# EAGLE design IRIS1304_v2.0 (EAGLE 6.6.0)

## Sheet 1 of 4
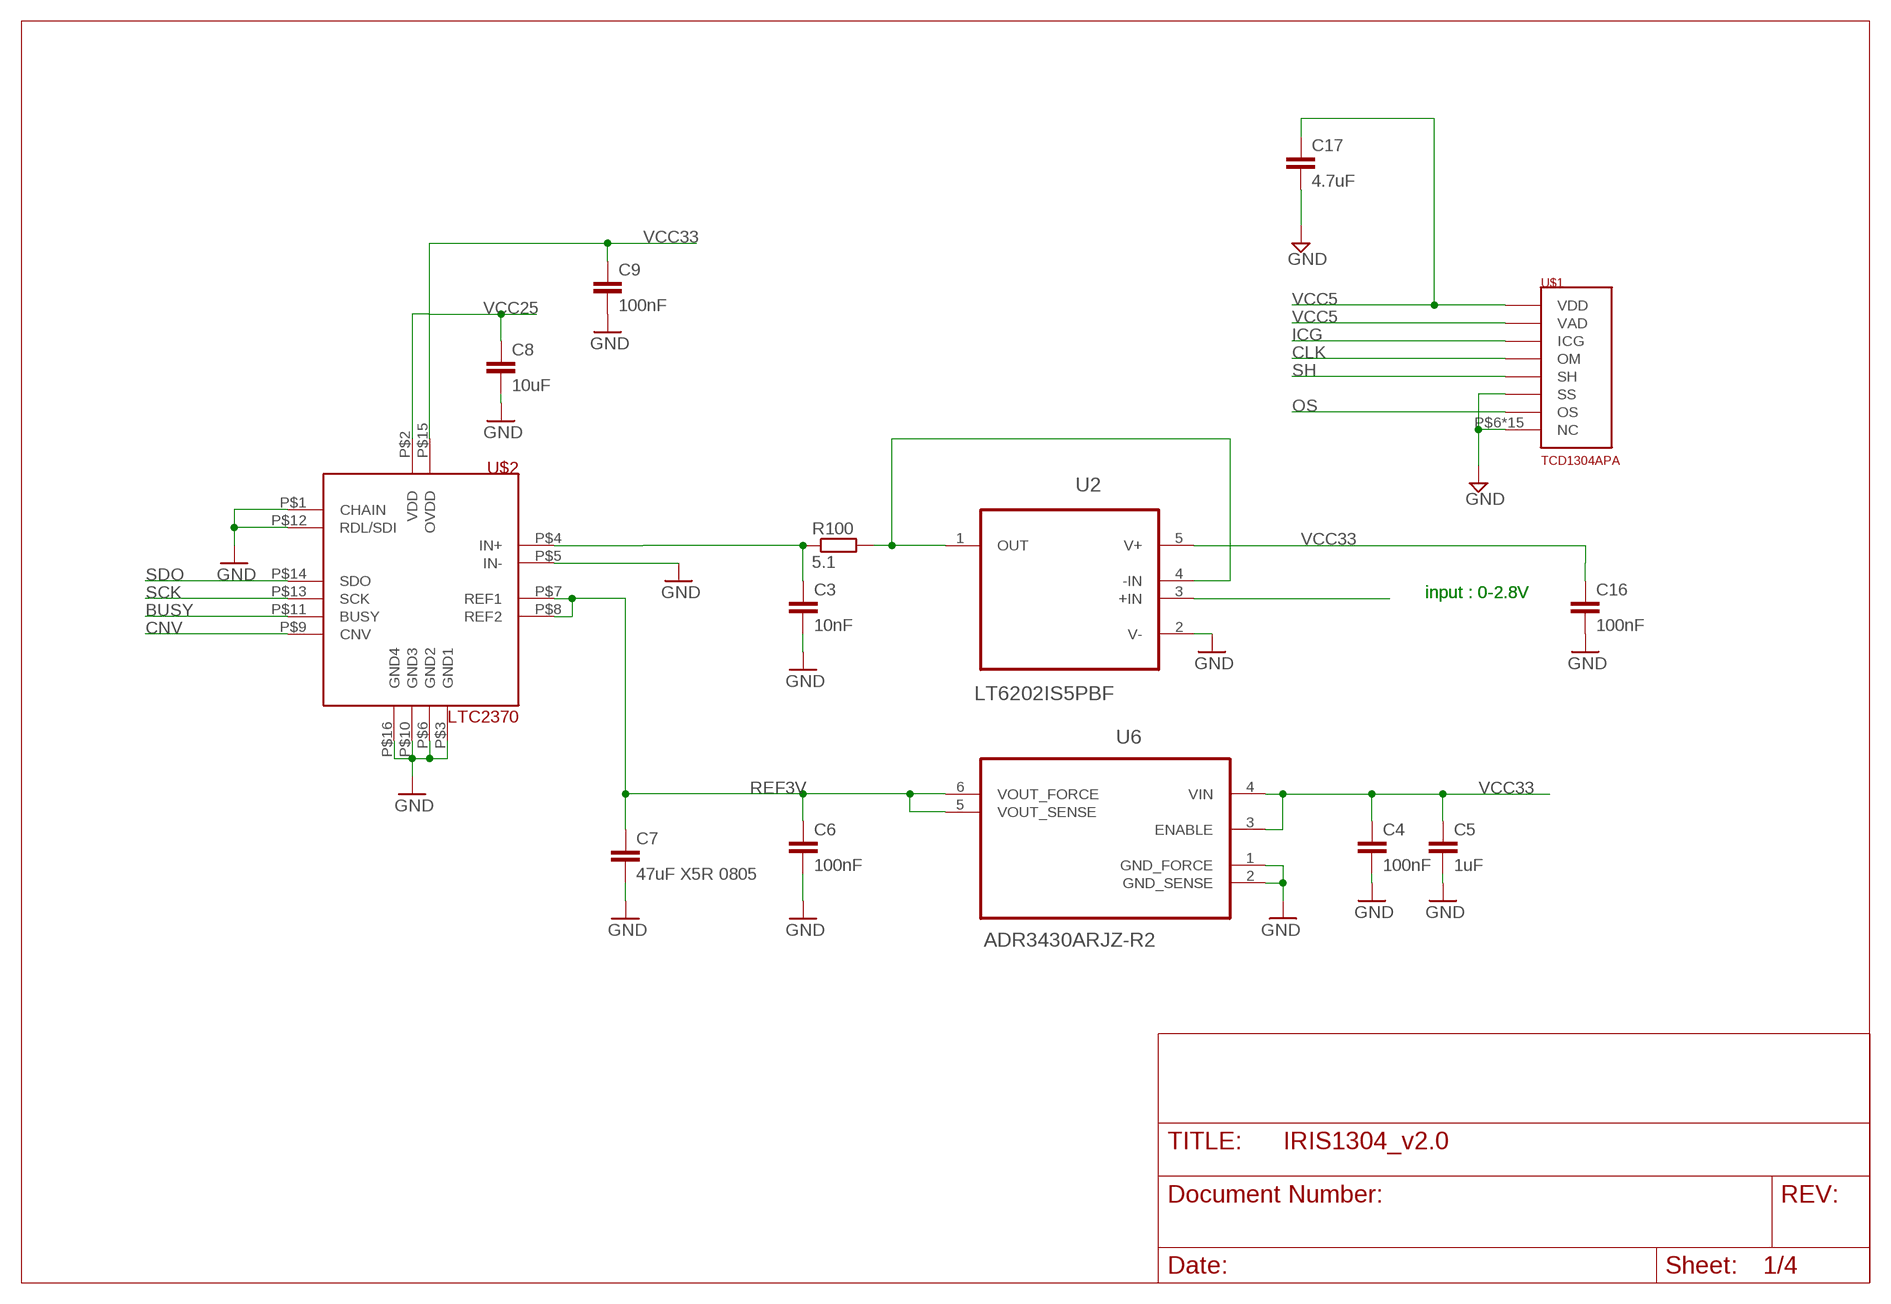
[diagram p0: schematic, sheet 1]

### Parts
C3  10nF  C-EUC0603  [C0603]
C4  100nF  C-EUC0603  [C0603]
C5  1uF  C-EUC0603  [C0603]
C6  100nF  C-EUC0603  [C0603]
C7  47uF X5R 0805  C-EUC0805  [C0805]
C8  10uF  C-EUC0603  [C0603]
C9  100nF  C-EUC0603  [C0603]
C16  100nF  C-EUC0603  [C0603]
C17  4.7uF  C-EUC0603  [C0603]
R100  5.1  R-EU_R0603  [R0603]
U2  LT6202IS5PBF  [SOT95P280X100-5N]
U6  ADR3430ARJZ-R2  [SOT95P280X145-6N]
U$1  TCD1304APA  [ILX511]
U$2  LTC2370  [MSOP-16]

### Nets
BUSY: U$2.P$11(BUSY) ; also sheet 2
CLK: U$1.P$4(OM) ; also sheet 2
CNV: U$2.P$9(CNV) ; also sheet 2
GND: C3.2 C4.2 C5.2 C6.2 C7.2 C8.2 C9.2 C16.2 C17.2 U2.2(V-) U6.1(GND_FORCE) U6.2(GND_SENSE) U$1.P$6(NC) U$1.P$7(NC) U$1.P$8(NC) U$1.P$9(NC) U$1.P$10(NC) U$1.P$11(NC) U$1.P$12(NC) U$1.P$13(NC) U$1.P$14(NC) U$1.P$15(NC) U$1.P$16(NC) U$1.P$17(NC) U$1.P$18(NC) U$1.P$19(NC) U$1.P$20(NC) U$1.P$22(SS) U$2.P$1(CHAIN) U$2.P$3(GND1) U$2.P$5(IN-) U$2.P$6(GND2) U$2.P$10(GND3) U$2.P$12(RDL/SDI) U$2.P$16(GND4) ; also sheet 2,3,4
ICG: U$1.P$3(ICG) ; also sheet 2
N$3: C3.1 R100.1 U$2.P$4(IN+)
N$11: R100.2 U2.1(OUT) U2.4(-IN)
OS: U2.3(+IN) U$1.P$21(OS)
REF3V: C6.1 C7.1 U6.5(VOUT_SENSE) U6.6(VOUT_FORCE) U$2.P$7(REF1) U$2.P$8(REF2)
SCK: U$2.P$13(SCK) ; also sheet 2
SDO: U$2.P$14(SDO) ; also sheet 2
SH: U$1.P$5(SH) ; also sheet 2
VCC5: C17.1 U$1.P$1(VDD) U$1.P$2(VAD) ; also sheet 3,4
VCC25: C8.1 U$2.P$2(VDD) ; also sheet 2,4
VCC33: C4.1 C5.1 C9.1 C16.1 U2.5(V+) U6.3(ENABLE) U6.4(VIN) U$2.P$15(OVDD) ; also sheet 2,3,4

### Notes on the sheet
- input : 0-2.8V | input : 0-2.8V

## Sheet 2 of 4
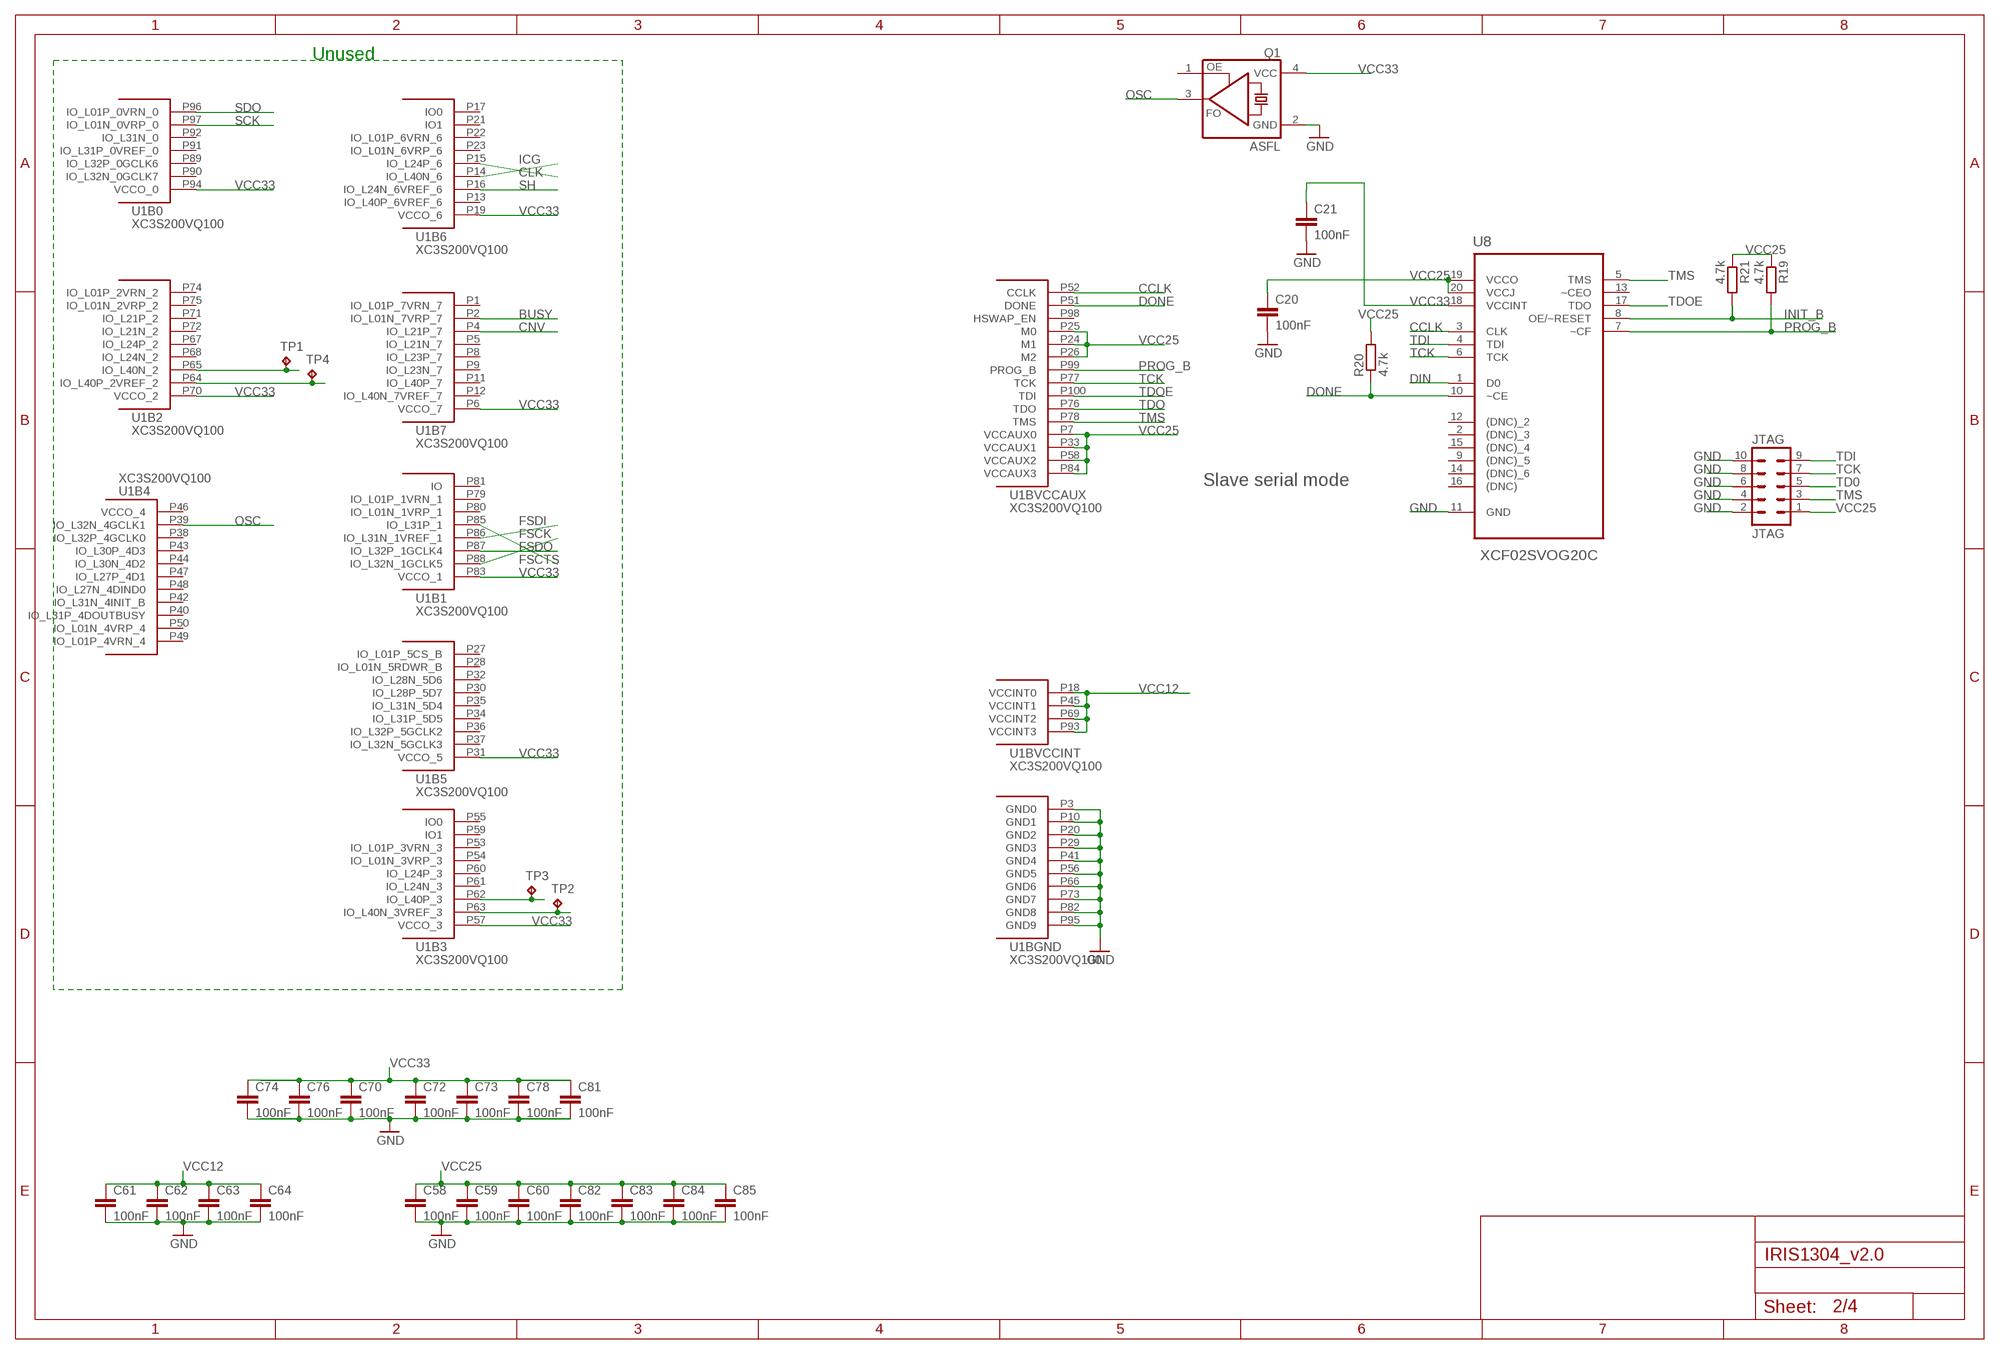
[diagram p1: schematic, sheet 2]

### Parts
C20  100nF  C-EUC0603  [C0603]
C21  100nF  C-EUC0603  [C0603]
C58  100nF  C-EUC0603  [C0603]
C59  100nF  C-EUC0603  [C0603]
C60  100nF  C-EUC0603  [C0603]
C61  100nF  C-EUC0603  [C0603]
C62  100nF  C-EUC0603  [C0603]
C63  100nF  C-EUC0603  [C0603]
C64  100nF  C-EUC0603  [C0603]
C70  100nF  C-EUC0603  [C0603]
C72  100nF  C-EUC0603  [C0603]
C73  100nF  C-EUC0603  [C0603]
C74  100nF  C-EUC0603  [C0603]
C76  100nF  C-EUC0603  [C0603]
C78  100nF  C-EUC0603  [C0603]
C81  100nF  C-EUC0603  [C0603]
C82  100nF  C-EUC0603  [C0603]
C83  100nF  C-EUC0603  [C0603]
C84  100nF  C-EUC0603  [C0603]
C85  100nF  C-EUC0603  [C0603]
JTAG  JTAG  ML10  [ML10]
Q1  ASFL  [ASF]
R19  4.7k  R-EU_R0603  [R0603]
R20  4.7k  R-EU_R0603  [R0603]
R21  4.7k  R-EU_R0603  [R0603]
TP1  TPB1,27  [B1,27]
TP2  TPB1,27  [B1,27]
TP3  TPB1,27  [B1,27]
TP4  TPB1,27  [B1,27]
U1  XC3S200VQ100  [VQ100]
U8  XCF02SVOG20C  [SOP65P640X119-20N]

### Nets
BUSY: U1.P2(B7:IO_L01N_7VRP_7) ; also sheet 1
CCLK: U1.P52(BVCCAUX:CCLK) U8.3(CLK)
CLK: U1.P15(B6:IO_L24P_6) ; also sheet 1
CNV: U1.P4(B7:IO_L21P_7) ; also sheet 1
DIN: U8.1(D0)
DONE: R20.1 U1.P51(BVCCAUX:DONE) U8.10(~CE)
FSCK: U1.P88(B1:IO_L32N_1GCLK5) ; also sheet 3
FSCTS: U1.P85(B1:IO_L31P_1) ; also sheet 3
FSDI: U1.P86(B1:IO_L31N_1VREF_1) ; also sheet 3
FSDO: U1.P87(B1:IO_L32P_1GCLK4) ; also sheet 3
GND: C20.2 C21.2 C58.2 C59.2 C60.2 C61.2 C62.2 C63.2 C64.2 C70.2 C72.2 C73.2 C74.2 C76.2 C78.2 C81.2 C82.2 C83.2 C84.2 C85.2 JTAG.2 JTAG.4 JTAG.6 JTAG.8 JTAG.10 Q1.2(GND) U1.P3(BGND:GND0) U1.P10(BGND:GND1) U1.P20(BGND:GND2) U1.P29(BGND:GND3) U1.P41(BGND:GND4) U1.P56(BGND:GND5) U1.P66(BGND:GND6) U1.P73(BGND:GND7) U1.P82(BGND:GND8) U1.P95(BGND:GND9) U8.11(GND) ; also sheet 1,3,4
ICG: U1.P14(B6:IO_L40N_6) ; also sheet 1
INIT_B: R21.2 U8.8(OE/~RESET)
N$1: TP2.TP U1.P63(B3:IO_L40N_3VREF_3)
N$2: TP4.TP U1.P64(B2:IO_L40P_2VREF_2)
N$4: TP3.TP U1.P62(B3:IO_L40P_3)
N$5: TP1.TP U1.P65(B2:IO_L40N_2)
OSC: Q1.3(FO) U1.P39(B4:IO_L32N_4GCLK1)
PROG_B: R19.2 U1.P99(BVCCAUX:PROG_B) U8.7(~CF)
SCK: U1.P97(B0:IO_L01N_0VRP_0) ; also sheet 1
SDO: U1.P96(B0:IO_L01P_0VRN_0) ; also sheet 1
SH: U1.P16(B6:IO_L24N_6VREF_6) ; also sheet 1
TCK: JTAG.7 U1.P77(BVCCAUX:TCK) U8.6(TCK)
TD0: JTAG.5
TDI: JTAG.9 U8.4(TDI)
TDO: U1.P76(BVCCAUX:TDO)
TDOE: U1.P100(BVCCAUX:TDI) U8.17(TDO)
TMS: JTAG.3 U1.P78(BVCCAUX:TMS) U8.5(TMS)
VCC12: C61.1 C62.1 C63.1 C64.1 U1.P18(BVCCINT:VCCINT0) U1.P45(BVCCINT:VCCINT1) U1.P69(BVCCINT:VCCINT2) U1.P93(BVCCINT:VCCINT3) ; also sheet 4
VCC25: C20.1 C58.1 C59.1 C60.1 C82.1 C83.1 C84.1 C85.1 JTAG.1 R19.1 R20.2 R21.1 U1.P7(BVCCAUX:VCCAUX0) U1.P24(BVCCAUX:M1) U1.P25(BVCCAUX:M0) U1.P26(BVCCAUX:M2) U1.P33(BVCCAUX:VCCAUX1) U1.P58(BVCCAUX:VCCAUX2) U1.P84(BVCCAUX:VCCAUX3) U8.19(VCCO) U8.20(VCCJ) ; also sheet 1,4
VCC33: C21.1 C70.1 C72.1 C73.1 C74.1 C76.1 C78.1 C81.1 Q1.4(VCC) U1.P6(B7:VCCO_7) U1.P19(B6:VCCO_6) U1.P31(B5:VCCO_5) U1.P57(B3:VCCO_3) U1.P70(B2:VCCO_2) U1.P83(B1:VCCO_1) U1.P94(B0:VCCO_0) U8.18(VCCINT) ; also sheet 1,3,4
Unconnected: Q1.1(OE) U1.P1(B7:IO_L01P_7VRN_7) U1.P5(B7:IO_L21N_7) U1.P8(B7:IO_L23P_7) U1.P9(B7:IO_L23N_7) U1.P11(B7:IO_L40P_7) U1.P12(B7:IO_L40N_7VREF_7) U1.P13(B6:IO_L40P_6VREF_6) U1.P17(B6:IO0) U1.P21(B6:IO1) U1.P22(B6:IO_L01P_6VRN_6) U1.P23(B6:IO_L01N_6VRP_6) U1.P27(B5:IO_L01P_5CS_B) U1.P28(B5:IO_L01N_5RDWR_B) U1.P30(B5:IO_L28P_5D7) U1.P32(B5:IO_L28N_5D6) U1.P34(B5:IO_L31P_5D5) U1.P35(B5:IO_L31N_5D4) U1.P36(B5:IO_L32P_5GCLK2) U1.P37(B5:IO_L32N_5GCLK3) U1.P38(B4:IO_L32P_4GCLK0) U1.P40(B4:IO_L31P_4DOUTBUSY) U1.P42(B4:IO_L31N_4INIT_B) U1.P43(B4:IO_L30P_4D3) U1.P44(B4:IO_L30N_4D2) U1.P46(B4:VCCO_4) U1.P47(B4:IO_L27P_4D1) U1.P48(B4:IO_L27N_4DIND0) U1.P49(B4:IO_L01P_4VRN_4) U1.P50(B4:IO_L01N_4VRP_4) U1.P53(B3:IO_L01P_3VRN_3) U1.P54(B3:IO_L01N_3VRP_3) U1.P55(B3:IO0) U1.P59(B3:IO1) U1.P60(B3:IO_L24P_3) U1.P61(B3:IO_L24N_3) U1.P67(B2:IO_L24P_2) U1.P68(B2:IO_L24N_2) U1.P71(B2:IO_L21P_2) U1.P72(B2:IO_L21N_2) U1.P74(B2:IO_L01P_2VRN_2) U1.P75(B2:IO_L01N_2VRP_2) U1.P79(B1:IO_L01P_1VRN_1) U1.P80(B1:IO_L01N_1VRP_1) U1.P81(B1:IO) U1.P89(B0:IO_L32P_0GCLK6) U1.P90(B0:IO_L32N_0GCLK7) U1.P91(B0:IO_L31P_0VREF_0) U1.P92(B0:IO_L31N_0) U1.P98(BVCCAUX:HSWAP_EN) U8.2((DNC)_3) U8.9((DNC)_5) U8.12((DNC)_2) U8.13(~CEO) U8.14((DNC)_6) U8.15((DNC)_4) U8.16((DNC))

### Notes on the sheet
- Unused
- Slave serial mode

## Sheet 3 of 4
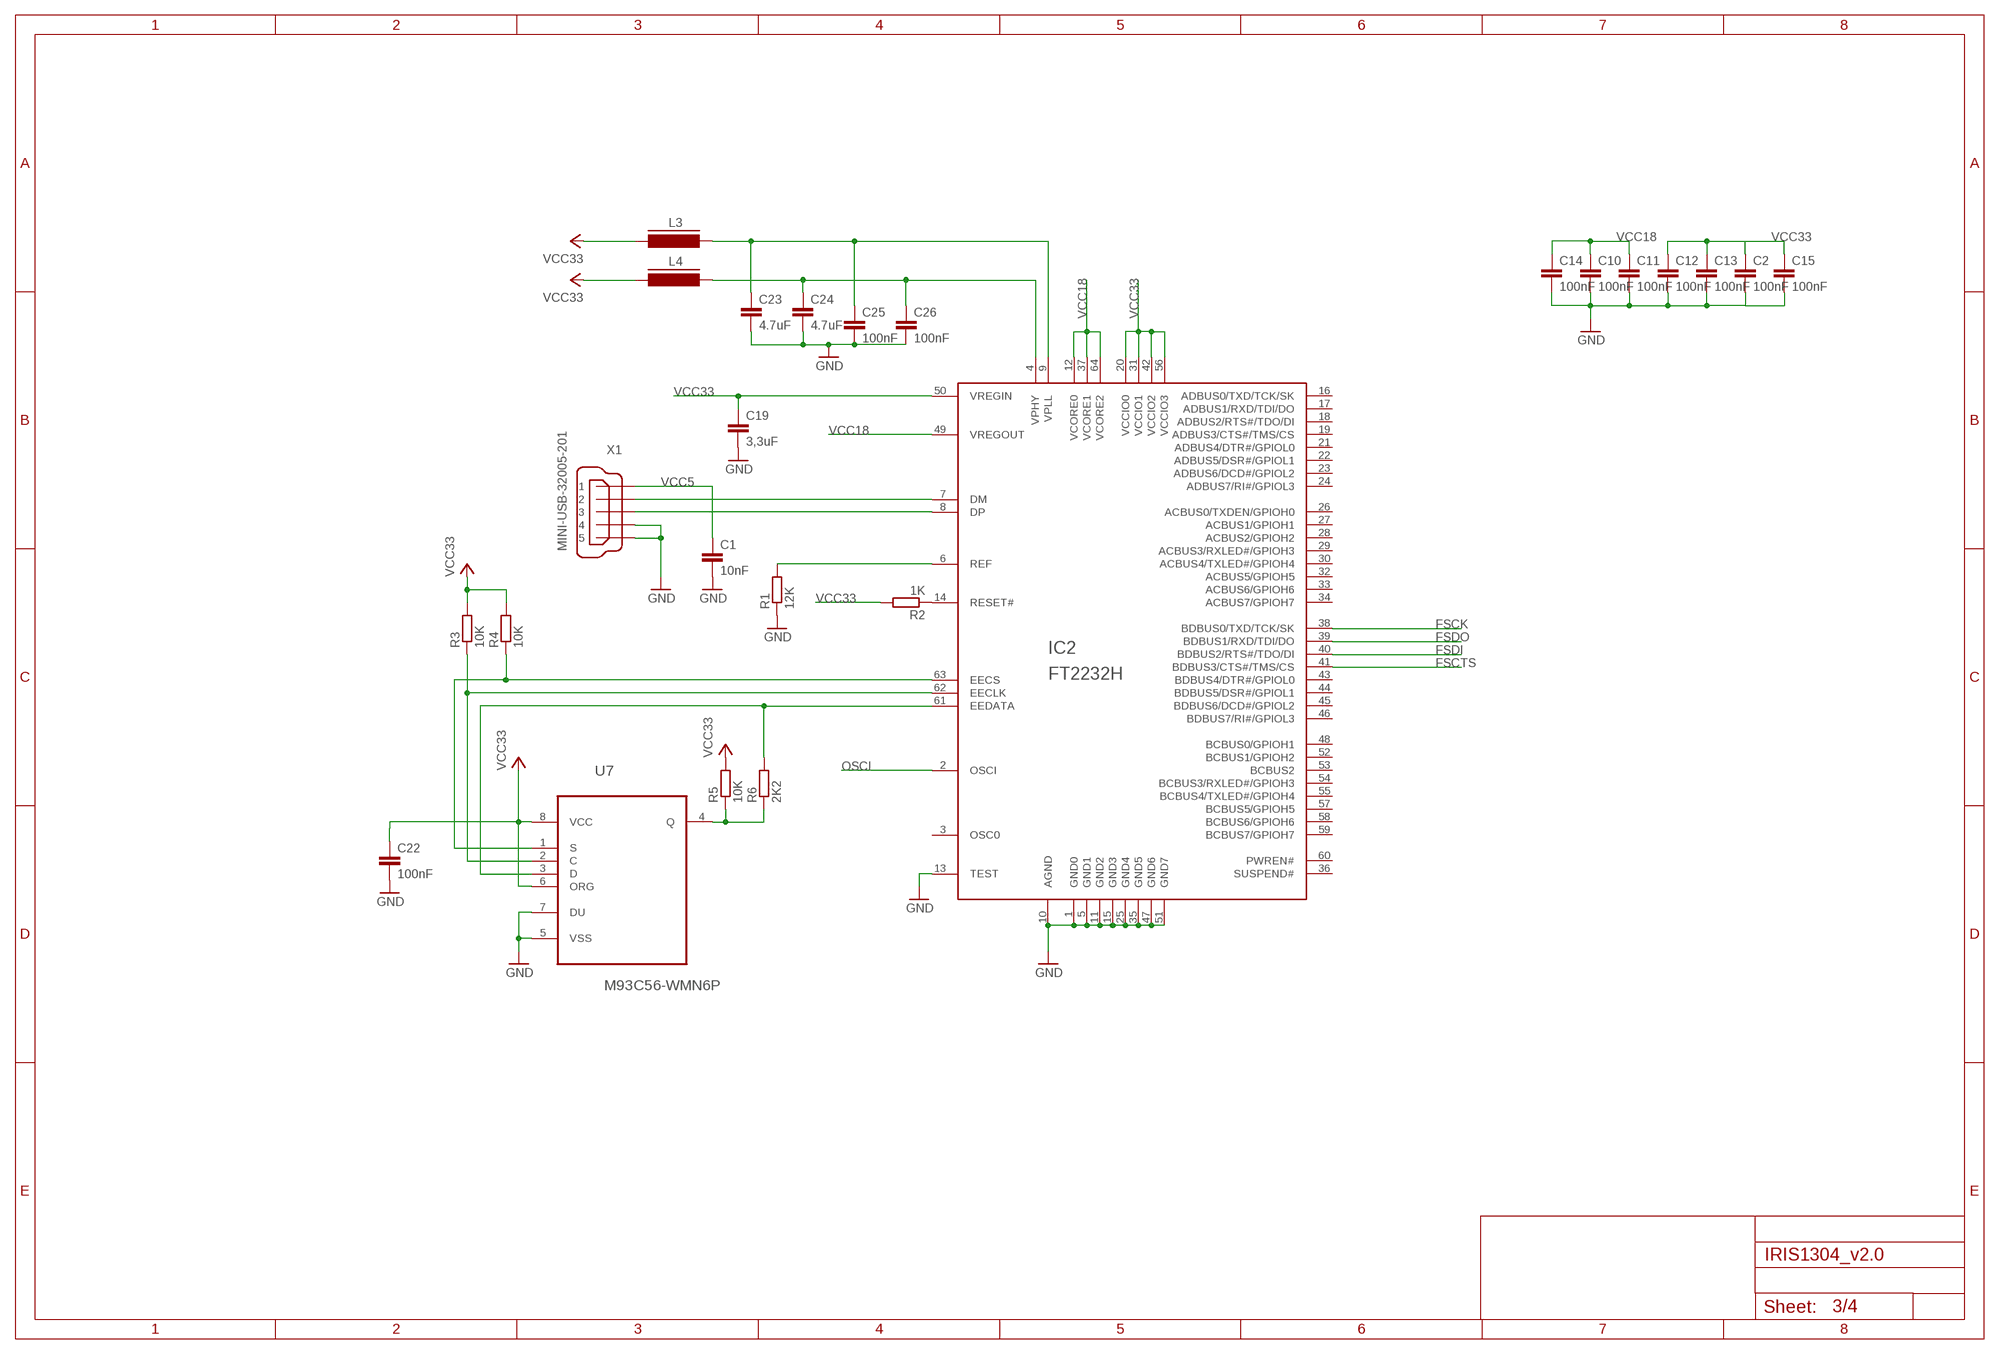
[diagram p2: schematic, sheet 3]

### Parts
C1  10nF  C-EUC0603  [C0603]
C2  100nF  C-EUC0603  [C0603]
C10  100nF  C-EUC0603  [C0603]
C11  100nF  C-EUC0603  [C0603]
C12  100nF  C-EUC0603  [C0603]
C13  100nF  C-EUC0603  [C0603]
C14  100nF  C-EUC0603  [C0603]
C15  100nF  C-EUC0603  [C0603]
C19  3,3uF  C-EUC0805  [C0805]
C22  100nF  C-EUC0603  [C0603]
C23  4.7uF  C-EUC0603  [C0603]
C24  4.7uF  C-EUC0603  [C0603]
C25  100nF  C-EUC0603  [C0603]
C26  100nF  C-EUC0603  [C0603]
IC2  FT2232H  [LQFP64]
L3  FERRITE_BEAD805  [FB805]
L4  FERRITE_BEAD805  [FB805]
R1  12K  R-EU_R0603  [R0603]
R2  1K  R-EU_R0603  [R0603]
R3  10K  R-EU_R0603  [R0603]
R4  10K  R-EU_R0603  [R0603]
R5  10K  R-EU_R0603  [R0603]
R6  2K2  R-EU_R0603  [R0603]
U7  M93C56-WMN6P  [SOIC127P600X175-8N]
X1  MINI-USB-32005-201  [32005-201]

### Nets
D+: IC2.8(DP) X1.3
D-: IC2.7(DM) X1.2
FSCK: IC2.38(BDBUS0/TXD/TCK/SK) ; also sheet 2
FSCTS: IC2.41(BDBUS3/CTS#/TMS/CS) ; also sheet 2
FSDI: IC2.40(BDBUS2/RTS#/TDO/DI) ; also sheet 2
FSDO: IC2.39(BDBUS1/RXD/TDI/DO) ; also sheet 2
GND: C1.2 C2.2 C10.2 C11.2 C12.2 C13.2 C14.2 C15.2 C19.2 C22.2 C23.2 C24.2 C25.2 C26.2 IC2.1(GND0) IC2.5(GND1) IC2.10(AGND) IC2.11(GND2) IC2.13(TEST) IC2.15(GND3) IC2.25(GND4) IC2.35(GND5) IC2.47(GND6) IC2.51(GND7) R1.1 U7.5(VSS) U7.7(DU) X1.4 X1.5 ; also sheet 1,2,4
N$8: IC2.6(REF) R1.2
N$9: R5.1 R6.1 U7.4(Q)
N$12: IC2.61(EEDATA) R6.2 U7.3(D)
N$13: IC2.63(EECS) R4.1 U7.1(S)
N$17: IC2.62(EECLK) R3.1 U7.2(C)
N$18: C24.1 C26.1 IC2.4(VPHY) L4.1
N$19: C23.1 C25.1 IC2.9(VPLL) L3.1
N$20: IC2.14(RESET#) R2.1
OSCI: IC2.2(OSCI)
VCC5: C1.1 X1.1 ; also sheet 1,4
VCC18: C10.1 C11.1 C14.1 IC2.12(VCORE0) IC2.37(VCORE1) IC2.49(VREGOUT) IC2.64(VCORE2)
VCC33: C2.1 C12.1 C13.1 C15.1 C19.1 C22.1 IC2.20(VCCIO0) IC2.31(VCCIO1) IC2.42(VCCIO2) IC2.50(VREGIN) IC2.56(VCCIO3) L3.2 L4.2 R2.2 R3.2 R4.2 R5.2 U7.6(ORG) U7.8(VCC) ; also sheet 1,2,4
Unconnected: IC2.3(OSC0) IC2.16(ADBUS0/TXD/TCK/SK) IC2.17(ADBUS1/RXD/TDI/DO) IC2.18(ADBUS2/RTS#/TDO/DI) IC2.19(ADBUS3/CTS#/TMS/CS) IC2.21(ADBUS4/DTR#/GPIOL0) IC2.22(ADBUS5/DSR#/GPIOL1) IC2.23(ADBUS6/DCD#/GPIOL2) IC2.24(ADBUS7/RI#/GPIOL3) IC2.26(ACBUS0/TXDEN/GPIOH0) IC2.27(ACBUS1/GPIOH1) IC2.28(ACBUS2/GPIOH2) IC2.29(ACBUS3/RXLED#/GPIOH3) IC2.30(ACBUS4/TXLED#/GPIOH4) IC2.32(ACBUS5/GPIOH5) IC2.33(ACBUS6/GPIOH6) IC2.34(ACBUS7/GPIOH7) IC2.36(SUSPEND#) IC2.43(BDBUS4/DTR#/GPIOL0) IC2.44(BDBUS5/DSR#/GPIOL1) IC2.45(BDBUS6/DCD#/GPIOL2) IC2.46(BDBUS7/RI#/GPIOL3) IC2.48(BCBUS0/GPIOH1) IC2.52(BCBUS1/GPIOH2) IC2.53(BCBUS2) IC2.54(BCBUS3/RXLED#/GPIOH3) IC2.55(BCBUS4/TXLED#/GPIOH4) IC2.57(BCBUS5/GPIOH5) IC2.58(BCBUS6/GPIOH6) IC2.59(BCBUS7/GPIOH7) IC2.60(PWREN#)

## Sheet 4 of 4
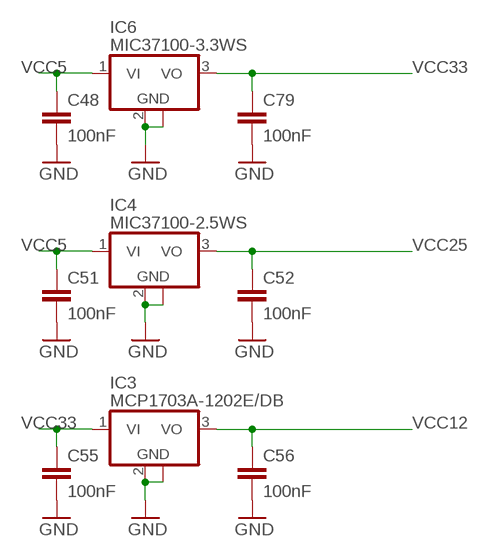
[diagram p3: schematic, sheet 4]

### Parts
C48  100nF  C-EUC0603  [C0603]
C51  100nF  C-EUC0603  [C0603]
C52  100nF  C-EUC0603  [C0603]
C55  100nF  C-EUC0603  [C0603]
C56  100nF  C-EUC0603  [C0603]
C79  100nF  C-EUC0603  [C0603]
IC3  MCP1703A-1202E/DB  UA78M05DCY  [SOT223]
IC4  MIC37100-2.5WS  UA78M05DCY  [SOT223]
IC6  MIC37100-3.3WS  UA78M05DCY  [SOT223]

### Nets
GND: C48.2 C51.2 C52.2 C55.2 C56.2 C79.2 IC3.2(GND) IC3.4(GND) IC4.2(GND) IC4.4(GND) IC6.2(GND) IC6.4(GND) ; also sheet 1,2,3
VCC5: C48.1 C51.1 IC4.1(VI) IC6.1(VI) ; also sheet 1,3
VCC12: C56.1 IC3.3(VO) ; also sheet 2
VCC25: C52.1 IC4.3(VO) ; also sheet 1,2
VCC33: C55.1 C79.1 IC3.1(VI) IC6.3(VO) ; also sheet 1,2,3

## Library data of the parts
C1 C3 = rcl:C-EU: CAPACITOR, European symbol; MF: AVX; MPN: 06035G103ZAT2A; OC_FARNELL: 317433
C2 C4 C6 C9-C16 C20-C22 C25 C26 C48 C51 C52 C55 C56 C58-C64 C70 C72-C74 C76 C78 C79 C81-C85 = rcl:C-EU: CAPACITOR, European symbol; MF: AVX; MPN: 06033G104ZAT2A; OC_FARNELL: 317287
C5 = rcl:C-EU: CAPACITOR, European symbol; MF: KEMET; MPN: C0603C105K3PACTU; OC_FARNELL: 1288202
C7 = rcl:C-EU: CAPACITOR, European symbol; MF: KEMET; MPN: C0805C476M9PACTU; OC_FARNELL: 1572633
C8 = rcl:C-EU: CAPACITOR, European symbol; MF: KEMET; MPN: C0603C106M9PACTU; OC_FARNELL: 1288201
C17 C23 C24 = rcl:C-EU: CAPACITOR, European symbol; MF: YAGEO (PHYCOMP); MPN: CC0603KRX5R6BB475; OC_FARNELL: 1458898
C19 = rcl:C-EU: CAPACITOR, European symbol; MF: AVX; MPN: 0805ZD335KAT2A; OC_FARNELL: 1301817
IC2 = DP-EagleLibrary:FT2232H: DUAL HIGH SPEED USB TO MULTIPURPOSE UART/FIFO IC; MF: FTDI; MPN: FT2232HL-R; OC_FARNELL: 1697461
IC3 = linear:UA78M*: POSITIVE-VOLTAGE REGULATORS Source: http://focus.ti.com/lit/ds/symlink/ua78m33.pdf; MF: MICROCHIP; MPN: MCP1703A-1202E/DB; OC_FARNELL: 2113886
IC4 = linear:UA78M*: POSITIVE-VOLTAGE REGULATORS Source: http://focus.ti.com/lit/ds/symlink/ua78m33.pdf; MF: MICREL SEMICONDUCTOR; MPN: MIC37100-2.5WS TR; OC_FARNELL: 2431751
IC6 = linear:UA78M*: POSITIVE-VOLTAGE REGULATORS Source: http://focus.ti.com/lit/ds/symlink/ua78m33.pdf; MF: MICREL SEMICONDUCTOR; MPN: MIC37100-3.3WS; OC_FARNELL: 2100300
JTAG = con-ml:ML10: HARTING; MF: SAMTEC; MPN: TFML-105-01-S-D-RA; OC_FARNELL: 1801377; OC_NEWARK: unknown
L3 L4 = dp_devices:FERRITE_BEAD; OC_FARNELL: unknown
Q1 = crystal:ASF*: CRYSTAL CLOCK OSCILLATORS 5.0 Vdc or 3.3 Vdc - LOW PROFILE ULTRA MINIATURE CERAMIC SURFACE MOUNT Source: http://www.abracon.com/Oscillators/asf1-L-L1.pdf; MF: ABRACON; MPN: ASFL1-12.000MHZ-EK-T; OC_FARNELL: 7943088; OC_NEWARK: 99M0411
R1 = rcl:R-EU_: RESISTOR, European symbol; MF: TE CONNECTIVITY; MPN: CPF0201D12K1C1; OC_FARNELL: 2117895
R2 = rcl:R-EU_: RESISTOR, European symbol; MF: VISHAY DRALORIC; MPN: CRCW06031K00FKEA; OC_FARNELL: 1469740
R3-R5 = rcl:R-EU_: RESISTOR, European symbol; MF: TE CONNECTIVITY / NEOHM; MPN: CPF0603F10KC1; OC_FARNELL: 1527581
R6 = rcl:R-EU_: RESISTOR, European symbol; MF: PANASONIC; MPN: ERJP03F2201V; OC_FARNELL: 1750676
R19-R21 = rcl:R-EU_: RESISTOR, European symbol; MF: VISHAY DRALORIC; MPN: CRCW06034K70FKEA; OC_FARNELL: 1469807
R100 = rcl:R-EU_: RESISTOR, European symbol; MF: VISHAY DALE; MPN: CRCW06035R10FNEA; OC_FARNELL: 1563921
TP1-TP4 = testpad:TP: Test pad; OC_FARNELL: unknown
U1 = SpectroLib:XC3S200VQ100: Xilinx FPGA; MF: XILINX; MPN: XC3S200A-4VQG100C; OC_FARNELL: 1876204
U2 = SpectroLib:LT6202IS5PBF: Low Power Op Amps; MF: LINEAR TECHNOLOGY; MPN: LT6202IS5#PBF; OC_FARNELL: 2102627; OC_NEWARK: 84R3670; PACKAGE: TSOT-23-5; SUPPLIER: Linear Technology
U6 = SpectroLib:ADR3430ARJZ-R2: Voltage References; MF: ANALOG DEVICES; MPN: ADR3430ARJZ-R2; OC_FARNELL: 1899425; OC_NEWARK: 76R7580; PACKAGE: SOT23-6; SUPPLIER: Analog Devices
U7 = IRIS:M93C56-WMN6P: MICROWIRE serial access EEPROM; MF: STMICROELECTRONICS; MPN: M93C56-WMN6P; OC_FARNELL: 9882448; OC_NEWARK: 26M1829; PACKAGE: SOIC-8; SUPPLIER: STMICROELECTRONICS
U8 = QUBIC:XCF02SVOG20C: Platform Flash In-System Programmable Configuration PROMS; DESCRIPTION: Platform Flash In-System Programmable Configuration PROMS; MF: XILINX; MPN: XCF02SVOG20C; OC_FARNELL: 1876178; OC_NEWARK: 40T2691; PACKAGE: TSSOP-20; SUPPLIER: XILINX
U$1 = SpectroLib:TCD1304AP; OC_FARNELL: unknown
U$2 = SpectroLib:LTC2370; MF: LINEAR TECHNOLOGY; MPN: LTC2370CMS-16; OC_FARNELL: 2068071
X1 = con-cypressindustries:MINI-USB-: MINI USB-B Conector Source: www.cypressindustries.com; MF: WURTH ELEKTRONIK; MPN: 65100516121; OC_FARNELL: 1642036; OC_NEWARK: unknown

## Board
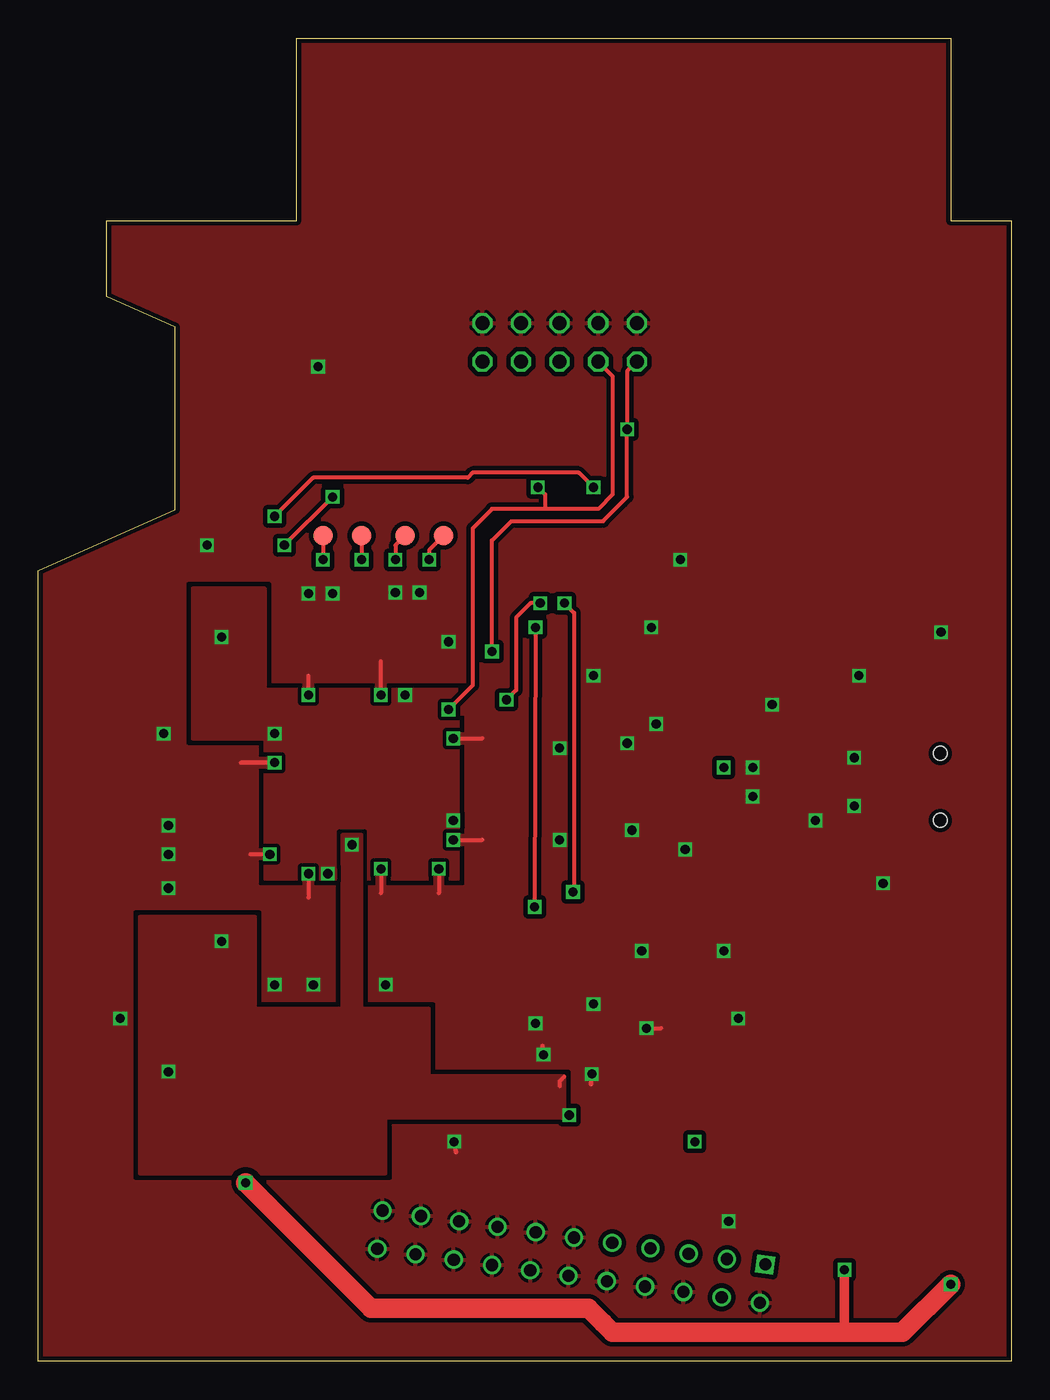
[diagram p4: board, top side]
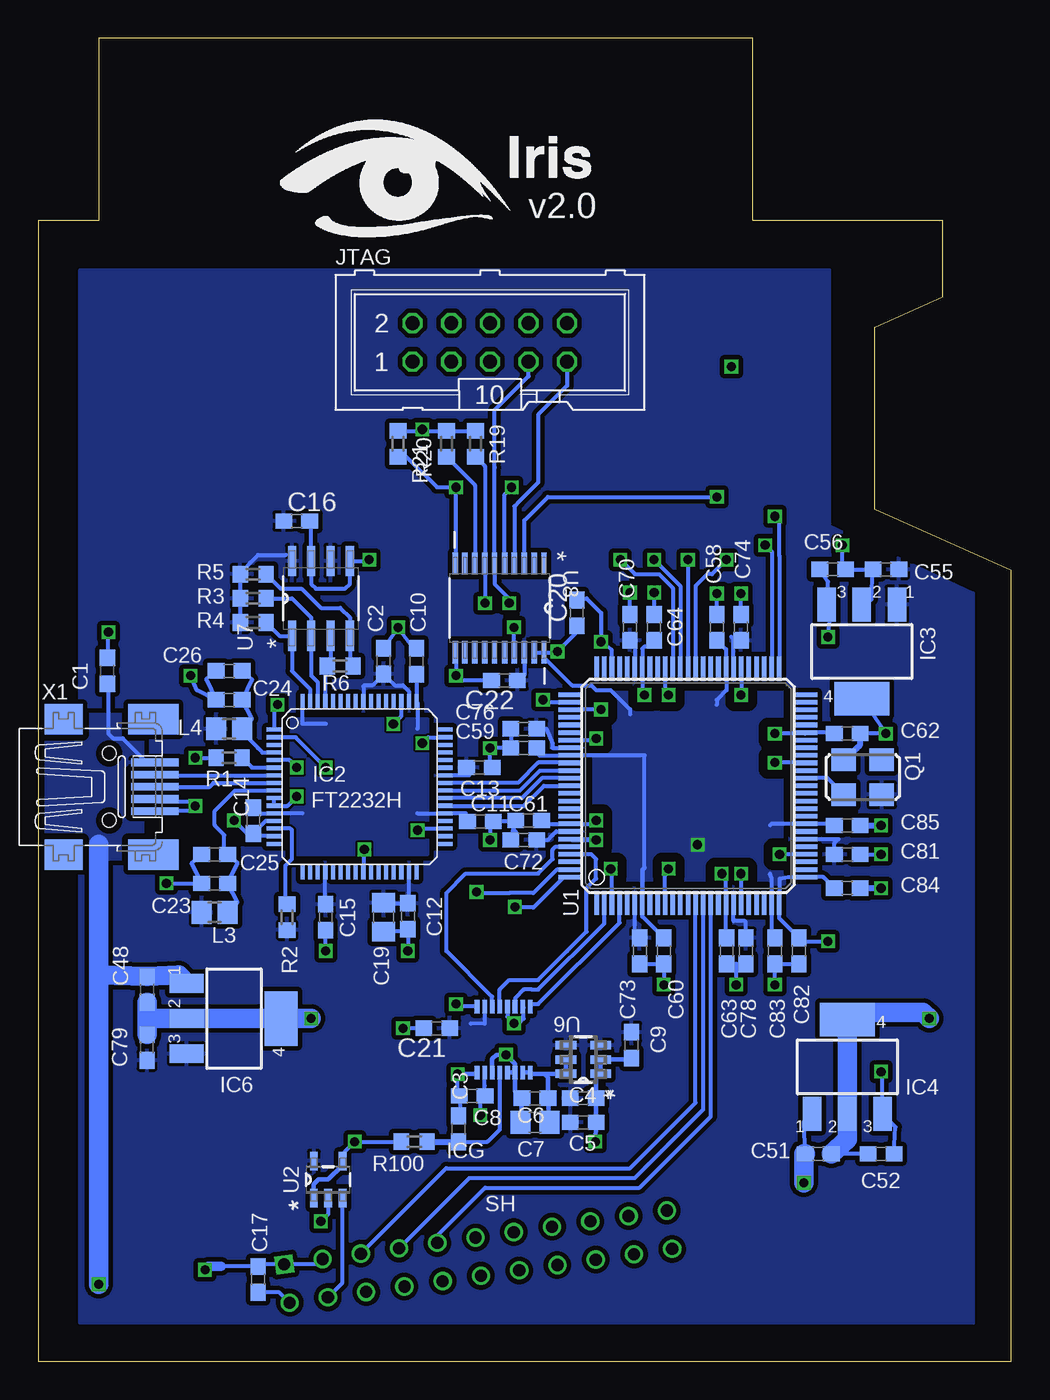
[diagram p5: board, bottom side, seen from below]

Size 64 x 87 mm. Coordinates in mm from the lower left corner, seen from the top.
Outline: 0,0 0,52 9,56 9,68 4.5,70 4.5,75 17,75 17,87 60,87 60,75 64,75 64,0 0,0
Copper layers (1*16): Top 0.035mm / dielectric 1.5mm / Bottom 0.035mm
Design rules "PCB-POOL Standard": minimum track width 0.15mm, minimum drill 0.3mm, track to track 0.15mm, track to pad 0.15mm, pad to pad 0.15mm, via to via 0.15mm, smd to smd 0.15mm, copper to edge 0.3mm, drill to drill 0.2mm, minimum pad ring 0.2mm, minimum via ring 0.15mm, stop-mask expansion 0.075mm, vias tented up to drill 0mil, thermal gap 0.2mm

### Footprints (pad centres in the part's own frame; a part is rotated, then mirrored left to right if it is on the bottom)
C0603 = smd 1.1 x 1: 1 -0.85,0; 2 0.85,0
C0805 = smd 1.3 x 1.5: 1 -0.95,0; 2 0.95,0
LQFP64 = smd 1 x 0.27: 1 -5.6,3.75; 2 -5.6,3.25; 3 -5.6,2.75; 4 -5.6,2.25; 5 -5.6,1.75; 6 -5.6,1.25; 7 -5.6,0.75; 8 -5.6,0.25; 9 -5.6,-0.25; 10 -5.6,-0.75; 11 -5.6,-1.25; 12 -5.6,-1.75; 13 -5.6,-2.25; 14 -5.6,-2.75; 15 -5.6,-3.25; 16 -5.6,-3.75; 33 5.6,-3.75; 34 5.6,-3.25; 35 5.6,-2.75; 36 5.6,-2.25; 37 5.6,-1.75; 38 5.6,-1.25; 39 5.6,-0.75; 40 5.6,-0.25; 41 5.6,0.25; 42 5.6,0.75; 43 5.6,1.25; 44 5.6,1.75; 45 5.6,2.25; 46 5.6,2.75; 47 5.6,3.25; 48 5.6,3.75 | smd 0.27 x 1: 17 -3.75,-5.6; 18 -3.25,-5.6; 19 -2.75,-5.6; 20 -2.25,-5.6; 21 -1.75,-5.6; 22 -1.25,-5.6; 23 -0.75,-5.6; 24 -0.25,-5.6; 25 0.25,-5.6; 26 0.75,-5.6; 27 1.25,-5.6; 28 1.75,-5.6; 29 2.25,-5.6; 30 2.75,-5.6; 31 3.25,-5.6; 32 3.75,-5.6; 49 3.75,5.6; 50 3.25,5.6; 51 2.75,5.6; 52 2.25,5.6; 53 1.75,5.6; 54 1.25,5.6; 55 0.75,5.6; 56 0.25,5.6; 57 -0.25,5.6; 58 -0.75,5.6; 59 -1.25,5.6; 60 -1.75,5.6; 61 -2.25,5.6; 62 -2.75,5.6; 63 -3.25,5.6; 64 -3.75,5.6
SOT223 = smd 1.219 x 2.235: 1 -2.311,-3.099; 2 0,-3.099; 3 2.311,-3.099 | smd 3.6 x 2.2: 4 0,3.099
ML10 = drill 0.914 octagon: 1 -5.08,-1.27; 2 -5.08,1.27; 3 -2.54,-1.27; 4 -2.54,1.27; 5 0,-1.27; 6 0,1.27; 7 2.54,-1.27; 8 2.54,1.27; 9 5.08,-1.27; 10 5.08,1.27
FB805 = smd 1.3 x 1.5: 1 -0.85,0; 2 0.85,0
ASF = smd 1.6 x 1.5: 1 -1.25,-1.15; 2 1.25,-1.15; 3 1.25,1.15; 4 -1.25,1.15
R0603 = smd 1 x 1.1: 1 -0.85,0; 2 0.85,0
B1,27 = smd 1.27 x 1.27: TP 0,0
VQ100 = smd 1.6 x 0.3: P1 -7.7,6; P2 -7.7,5.5; P3 -7.7,5; P4 -7.7,4.5; P5 -7.7,4; P6 -7.7,3.5; P7 -7.7,3; P8 -7.7,2.5; P9 -7.7,2; P10 -7.7,1.5; P11 -7.7,1; P12 -7.7,0.5; P13 -7.7,0; P14 -7.7,-0.5; P15 -7.7,-1; P16 -7.7,-1.5; P17 -7.7,-2; P18 -7.7,-2.5; P19 -7.7,-3; P20 -7.7,-3.5; P21 -7.7,-4; P22 -7.7,-4.5; P23 -7.7,-5; P24 -7.7,-5.5; P25 -7.7,-6; P51 7.7,-6; P52 7.7,-5.5; P53 7.7,-5; P54 7.7,-4.5; P55 7.7,-4; P56 7.7,-3.5; P57 7.7,-3; P58 7.7,-2.5; P59 7.7,-2; P60 7.7,-1.5; P61 7.7,-1; P62 7.7,-0.5; P63 7.7,0; P64 7.7,0.5; P65 7.7,1; P66 7.7,1.5; P67 7.7,2; P68 7.7,2.5; P69 7.7,3; P70 7.7,3.5; P71 7.7,4; P72 7.7,4.5; P73 7.7,5; P74 7.7,5.5; P75 7.7,6 | smd 0.3 x 1.6: P26 -6,-7.7; P27 -5.5,-7.7; P28 -5,-7.7; P29 -4.5,-7.7; P30 -4,-7.7; P31 -3.5,-7.7; P32 -3,-7.7; P33 -2.5,-7.7; P34 -2,-7.7; P35 -1.5,-7.7; P36 -1,-7.7; P37 -0.5,-7.7; P38 0,-7.7; P39 0.5,-7.7; P40 1,-7.7; P41 1.5,-7.7; P42 2,-7.7; P43 2.5,-7.7; P44 3,-7.7; P45 3.5,-7.7; P46 4,-7.7; P47 4.5,-7.7; P48 5,-7.7; P49 5.5,-7.7; P50 6,-7.7; P76 6,7.7; P77 5.5,7.7; P78 5,7.7; P79 4.5,7.7; P80 4,7.7; P81 3.5,7.7; P82 3,7.7; P83 2.5,7.7; P84 2,7.7; P85 1.5,7.7; P86 1,7.7; P87 0.5,7.7; P88 0,7.7; P89 -0.5,7.7; P90 -1,7.7; P91 -1.5,7.7; P92 -2,7.7; P93 -2.5,7.7; P94 -3,7.7; P95 -3.5,7.7; P96 -4,7.7; P97 -4.5,7.7; P98 -5,7.7; P99 -5.5,7.7; P100 -6,7.7
SOT95P280X100-5N = smd 1.219 x 0.508: 1 -1.219,0.94; 2 -1.219,0; 3 -1.219,-0.94; 4 1.219,-0.94; 5 1.219,0.94
SOT95P280X145-6N = smd 1.372 x 0.559: 1 -1.143,0.94; 2 -1.143,0; 3 -1.143,-0.94; 4 1.143,-0.94; 5 1.143,0; 6 1.143,0.94
SOIC127P600X175-8N = smd 1.981 x 0.533: 1 -2.464,1.905; 2 -2.464,0.635; 3 -2.464,-0.635; 4 -2.464,-1.905; 5 2.464,-1.905; 6 2.464,-0.635; 7 2.464,0.635; 8 2.464,1.905
SOP65P640X119-20N = smd 1.473 x 0.356: 1 -2.921,2.921; 2 -2.921,2.286; 3 -2.921,1.626; 4 -2.921,0.965; 5 -2.921,0.33; 6 -2.921,-0.33; 7 -2.921,-0.965; 8 -2.921,-1.626; 9 -2.921,-2.286; 10 -2.921,-2.921; 11 2.921,-2.921; 12 2.921,-2.286; 13 2.921,-1.626; 14 2.921,-0.965; 15 2.921,-0.33; 16 2.921,0.33; 17 2.921,0.965; 18 2.921,1.626; 19 2.921,2.286; 20 2.921,2.921
ILX511 = drill 0.8 square: P$1 0,0 | drill 0.8: P$2 -2.54,0; P$3 -5.08,0; P$4 -7.62,0; P$5 -10.16,0; P$6 -12.7,0; P$7 -15.24,0; P$8 -17.78,0; P$9 -20.32,0; P$10 -22.86,0; P$11 -25.4,0; P$12 -25.4,-2.54; P$13 -22.86,-2.54; P$14 -20.32,-2.54; P$15 -17.78,-2.54; P$16 -15.24,-2.54; P$17 -12.7,-2.54; P$18 -10.16,-2.54; P$19 -7.62,-2.54; P$20 -5.08,-2.54; P$21 -2.54,-2.54; P$22 0,-2.54
MSOP-16 = smd 0.305 x 0.889: P$1 0,-4.34; P$2 0.5,-4.34; P$3 1,-4.34; P$4 1.5,-4.34; P$5 2,-4.34; P$6 2.5,-4.34; P$7 3,-4.34; P$8 3.5,-4.34; P$9 3.5,0; P$10 3,0; P$11 2.5,0; P$12 2,0; P$13 1.5,0; P$14 1,0; P$15 0.5,0; P$16 0,0
32005-201 = smd 3.1 x 0.5: 1 3,1.6; 2 3,0.8; 3 3,0; 4 3,-0.8; 5 3,-1.6 | smd 2.5 x 2: M1 -3,-4.45; M2 -3,4.45 | smd 3.3 x 2: M3 2.9,4.45; M4 2.9,-4.45 | hole 0.9: 0,2.2; 0,-2.2

### Placement (x,y rotation side)
C1  59.43,45.41 90 bottom
C2  41.27,46.04 90 bottom
C3  36.35,15.29 90 bottom
C4  28.15,17.31 0 bottom
C5  28.15,15.72 0 bottom
C6  31.33,17.31 180 bottom
C7  31.33,15.72 180 bottom
C8  35.45,17.47 180 bottom
C9  24.98,20.8 270 bottom
C10  39.11,46.03 90 bottom
C11  34.92,35.5 0 bottom
C12  39.69,29.27 270 bottom
C13  34.98,39.05 0 bottom
C14  49.85,35.56 270 bottom
C15  45.09,29.21 270 bottom
C16  46.99,55.24 0 bottom
C17  49.53,5.4 270 bottom
C19  41.27,29.21 270 bottom
C20  28.57,49.21 90 bottom
C21  37.78,21.91 180 bottom
C22  33.34,44.77 180 bottom
C23  52.39,31.43 180 bottom
C24  51.44,43.5 180 bottom
C25  52.39,33.34 180 bottom
C26  51.44,45.4 180 bottom
C48  56.83,24.45 270 bottom
C51  12.7,13.65 0 bottom
C52  8.57,13.65 180 bottom
C55  8.26,52.07 180 bottom
C56  11.75,52.07 0 bottom
C58  19.37,48.26 90 bottom
C59  32.07,40.32 180 bottom
C60  22.86,26.99 270 bottom
C61  31.75,35.56 180 bottom
C62  10.79,41.27 0 bottom
C63  18.73,26.99 270 bottom
C64  23.5,48.26 90 bottom
C70  25.08,48.26 90 bottom
C72  32.07,34.29 180 bottom
C73  24.45,26.99 270 bottom
C74  17.78,48.26 90 bottom
C76  32.07,41.59 180 bottom
C78  17.46,26.99 270 bottom
C79  56.83,20.64 90 bottom
C81  10.79,33.34 0 bottom
C82  13.97,26.99 270 bottom
C83  15.56,26.99 270 bottom
C84  10.79,31.11 0 bottom
C85  10.79,35.24 0 bottom
IC2  42.86,37.78 0 bottom
IC3  9.84,46.67 180 bottom
IC4  10.79,19.37 0 bottom
IC6  51.12,22.54 270 bottom
JTAG  34.29,66.99 0 bottom
L3  52.39,29.53 180 bottom
L4  51.44,41.59 180 bottom
Q1  9.78,38.41 180 bottom
R1  51.44,39.69 0 bottom
R2  47.62,29.21 270 bottom
R3  49.85,50.16 180 bottom
R4  49.85,48.58 180 bottom
R5  49.85,51.75 180 bottom
R6  44.13,45.72 180 bottom
R19  35.24,60.33 270 bottom
R20  40.32,60.33 90 bottom
R21  37.15,60.33 270 bottom
R100  39.27,14.45 180 bottom
TP1  26.67,54.29 0 top
TP2  21.27,54.29 0 top
TP3  18.73,54.29 0 top
TP4  24.13,54.29 0 top
U1  21.27,37.84 90 bottom
U2  44.92,11.96 90 bottom
U6  28.15,19.85 180 bottom
U7  45.4,50.16 90 bottom
U8  33.66,49.53 270 bottom
U$1  47.81,6.38 352 top
U$2  35.14,23.34 0 bottom
X1  59.31,37.78 0 bottom

### Tracks (layer width: path | path; a pad name or v marks a point on that pad's centre or on a via)
BUSY
  Bottom 0.254: U1.P2 26.77,28.8 31.11,24.45 31.53,24.45 32.07,24.45 32.64,23.88 U$2.P$11
CCLK  (via drill 0.6)
  Top 0.254: v19.37,56.83 v16.19,53.66
  Bottom 0.254: U8.3 32.03,55.28 30.48,56.83 v19.37,56.83 | 16.03,53.5 v16.19,53.66 16.03,53.5 | 16.03,53.5 15.77,53.23 U1.P52
CLK
  Bottom 0.254: U$1.P$4 35.64,12.06 24.77,12.06 20.27,16.56 U1.P15
CNV
  Bottom 0.254: U$2.P$9 31.48,23.5 31.11,23.5 25.77,28.84 U1.P4
D+
  Bottom 0.254: X1.3 52.7,37.78 52.45,38.03 IC2.8
D-
  Bottom 0.254: X1.2 56.31,38.53 IC2.7
DONE  (via drill 0.6)
  Top 0.254: v36.51,57.47 35.56,58.42 28.57,58.42 | 28.57,58.42 28.26,58.1 | 28.26,58.1 18.1,58.1 v15.56,55.56 | 28.57,58.42 28.26,58.1
  Bottom 0.254: U8.10 36.51,52.51 v36.51,57.47 37.78,57.47 39.79,59.48 R20.1 | U1.P51 15.27,52.99 15.27,55.27 v15.56,55.56
FSCK
  Bottom 0.254: IC2.38 37.24,36.51 32.07,36.51 30.74,37.84 U1.P88
FSCTS
  Bottom 0.254: U1.P85 29,39.37 31.11,39.37 32.45,38.03 IC2.41
FSDI
  Bottom 0.254: IC2.40 32.32,37.53 31.11,38.73 31.01,38.84 U1.P86
FSDO
  Bottom 0.254: IC2.39 32.18,37.03 31.11,38.1 30.87,38.34 U1.P87
GND  (via drill 0.6)
  Top 0.254: v17.78,32.07 17.78,30.48 | v26.35,32.38 26.35,30.8 | v22.54,32.38 22.54,30.8 | v17.78,43.81 17.78,45.09 | v26.99,47.31 27.3,47.31 | v15.24,33.34 13.97,33.34 | v27.3,40.96 29.21,40.96 | v27.3,34.29 29.21,34.29 | v22.54,43.81 22.54,46.04 | v40.01,21.91 40.96,21.91 | v15.56,39.37 13.34,39.37 v15.56,39.37
  Top 0.305: v36.41,18.89 36.36,18.2 | v33.23,20.16 33.18,20.74 | v27.36,14.45 27.47,13.76
  Bottom 0.254: U1.P41 13.6,39.37 v15.56,39.37 | 17.77,43.83 U1.P56 17.77,43.83 | U1.P20 17.77,32.05 v17.78,32.07 | U1.P29 v15.23,33.34 v15.24,33.34 | U1.P3 26.27,32.15 v26.35,32.38 | U1.P10 22.77,31.98 v22.54,32.38 | 17.77,43.83 v17.78,43.81 | U1.P73 26.27,46.76 v26.99,47.31 26.99,49.21 27.94,50.16 C20.2 | C12.2 39.85,28.26 | 39.85,28.26 C19.2 | C2.2 v40.32,48.26 39.43,47.05 C10.2 | 39.85,28.26 39.69,28.09 v39.69,26.99 | v45.09,26.99 C15.2 | v53.66,39.69 R1.1 | X1.5 53.99,36.18 v53.66,36.51 53.98,36.83 56.16,36.83 X1.4 | v42.23,52.7 42.3,52.63 U7.5 43.5,51.12 43.81,50.8 45.72,50.8 46.04,51.12 U7.7 46.04,55.24 C16.2 | C26.2 52.94,44.85 C24.2 53.57,44.13 v53.98,45.09 | C25.2 53.89,32.79 C23.2 v55.56,31.43 | v59.37,47.94 59.43,47.56 C1.2 | C11.2 34.13,35.56 | C14.2 49.02,35.53 IC2.13 | v51.12,35.56 50.27,34.71 C14.2 | U$2.P$16 36.36,23.34 v36.51,23.5 | U$2.P$10 32.07,23.27 32.07,22.54 32.38,22.23 v32.7,22.23 33.14,22.66 U$2.P$12 | U2.2 44.92,9.69 v45.4,9.21 | U$1.P$22 48.14,4.55 C17.2 | v15.56,24.77 C83.2 C82.2 | C81.2 v8.57,33.34 | C74.2 v17.78,50.48 | C62.2 v8.26,41.27 IC3.4 | C63.2 18.1,26.14 | 18.1,26.14 C78.2 | v18.1,24.77 18.1,26.14 | v23.49,50.54 v23.5,50.54 C64.2 | C11.2 33.97,35.6 | 32.7,34.92 32.6,34.82 C72.2 C61.2 32.66,35.5 C11.2 | C13.2 34.29,38.88 v34.29,40.32 C59.2 C76.2 | U1.P82 27.42,40.84 v27.3,40.96 | 22.77,44.1 U1.P66 22.77,44.04 v22.54,43.81 | U8.11 36.51,46.55 v36.51,45.09 36.2,44.77 C22.2 | v46.99,39.05 47.47,39.53 IC2.5 | v38.73,40.64 38.34,41.03 IC2.47 | v39.05,34.92 38.95,35.03 IC2.35 | v42.55,33.66 42.61,33.59 IC2.25 | v40.64,41.91 40.11,42.44 IC2.51 | IC2.10 IC2.11 47.6,36.53 v46.99,37.15 | IC2.15 49.67,34.53 arc90 C14.2
  Bottom 0.254: IC3.2 9.21,50.09 C55.2 C56.2 11.11,52.07 v11.11,53.66 | C52.2 C51.2 | IC4.4 10.79,22.96 | v48.26,43.18 48.46,42.98 IC2.1 | C70.2 v25.08,50.54 | C58.2 v19.37,50.48 | C73.2 C60.2 v22.86,24.77 | C11.2 34.29,35.28 v34.29,34.29 | C21.2 v40.01,21.91 | C3.2 36.15,16.35 C8.2 36.41,17.73 v36.41,18.89 | U1.P95 27.57,34.34 v27.3,34.29 28.91,34.29 U1.P95
  Bottom 0.305: C5.2 C4.2 | C4.2 27.3,18.61 U6.1 U6.2 24.98,19.85 C9.2 | C7.2 C6.2 32.64,17.77 U$2.P$6 | U$2.P$1 35.24,18.89 v36.41,18.89 | U$2.P$6 32.64,19.57 v33.23,20.16 33.87,20.16 34.14,19.89 U$2.P$3 | U$2.P$6 U$2.P$5 | C4.2 27.3,15.62 v27.36,14.45
  Bottom 0.406: C84.2 v8.57,31.11 | C85.2 v8.57,35.24 | Q1.2 10.92,39.56 10.16,40.32 9.95,40.54 C62.2
  Bottom 1.27: 10.79,22.96 5.82,22.96 v5.4,22.54 | IC4.4 IC4.2 10.79,14.61 C51.2 | C79.2 56.83,22.54 | 56.83,22.54 C48.2 | 56.83,22.54 IC6.2 IC6.4 v46.04,22.54
  other vias: 18.41,65.41
  pour Top (isolate 0.305, rank 6): -1.27,87.63 -1.27,-0.95 64.77,-0.95 64.77,87.95 -1.27,87.95
ICG
  Bottom 0.254: U$1.P$3 37.17,12.7 25.08,12.7 20.77,17.02 U1.P14
INIT_B
  Bottom 0.254: R21.2 35.28,57.61 U8.8
N$1  (via drill 0.6)
  Top 0.254: TP2.TP v21.27,52.7
  Bottom 0.254: v21.27,52.7 21.27,52.38 U1.P63
N$2  (via drill 0.6)
  Top 0.254: TP4.TP 23.5,53.66 v23.5,52.7
  Bottom 0.254: v23.5,52.7 21.77,50.98 U1.P64
N$3
  Bottom 0.254: C3.1 34.45,14.45 33.64,15.26 U$2.P$4
  Bottom 0.305: 33.65,19 U$2.P$4
  Bottom 0.406: R100.1 C3.1
N$4  (via drill 0.6)
  Top 0.254: TP3.TP v18.73,52.7
  Bottom 0.254: v18.73,52.7 19.68,51.75 20,51.75 20.77,50.99 U1.P62
N$5  (via drill 0.6)
  Top 0.254: TP1.TP 25.72,53.34 v25.72,52.7
  Bottom 0.254: v25.72,52.7 24.77,51.75 23.18,51.75 22.27,50.84 U1.P65
N$8
  Bottom 0.254: R1.2 49.93,39.03 IC2.6
N$9
  Bottom 0.254: R5.1 48.05,50.8 46.67,50.8 45.4,49.53 44.13,49.53 43.5,48.9 U7.4 43.5,45.94 R6.1
N$11  (via drill 0.6)
  Bottom 0.254: U2.4 43.81,13.35 43.81,13.49 43.81,13.81 | 43.81,13.81 v43.18,14.45 | v43.18,14.45 R100.2 | 43.81,13.81 v43.18,14.45
  Bottom 0.305: U2.4 43.98,12.9 44.92,11.96 45.56,11.96 45.88,11.64 45.88,10.75 U2.1
  Bottom 0.406: 45.88,10.74 U2.1
N$12
  Bottom 0.254: U7.3 44.77,45.94 R6.2 45.11,45.59 IC2.61
N$13
  Bottom 0.254: R4.1 48.12,47.7 U7.1 47.31,45.4 46.11,44.21 IC2.63
N$17
  Bottom 0.254: R3.1 47.31,50.16 46.35,49.21 46.04,48.9 U7.2 46.04,45.09 45.61,44.66 IC2.62
N$18
  Bottom 0.254: IC2.4 49.24,40.03 49.53,40.32 50.59,41.38 L4.1 49.94,42.24 C24.1 49.94,44.85 C26.1
N$19
  Bottom 0.254: L3.1 50.89,30.18 C23.1 50.89,32.79 C25.1 51.75,33.65 51.75,34.61 52.39,35.24 52.39,36.2 51.05,37.53 IC2.9
N$20
  Bottom 0.254: IC2.14 47.41,35.03 47.31,34.92 47.31,33.02 47.73,32.6 47.73,30.16 R2.1
OS
  Bottom 0.254: U$1.P$21 43.98,5.18 U2.3
OSC
  Bottom 0.254: Q1.3 12.11,38.34 U1.P39
OSCI  (via drill 0.6)
  Bottom 0.254: v45.09,39.05 47.06,41.03 IC2.2
PROG_B  (via drill 0.6)
  Top 0.254: v34.61,49.85 35.24,49.21 35.24,34.29 35.24,31.25 v35.17,30.86
  Bottom 0.254: v34.61,49.85 34.61,52.44 U8.7 34.62,58.85 R19.2 | U1.P99 29.17,32.34 29.89,32.34 31.43,30.8 33.01,30.8 35.1,30.8 v35.17,30.86
REF3V
  Bottom 0.305: U$2.P$7 U$2.P$8 31.55,18.91 30.69,18.91 | 30.69,18.91 U6.6 U6.5 | C7.1 C6.1 30.48,18.69 30.69,18.91
SCK
  Bottom 0.254: U$2.P$13 33.66,23.36 33.66,24.45 33.02,25.08 31.11,25.08 29.21,26.99 27.94,28.26 27.94,31.11 27.3,31.75 27.3,33.02 27.63,33.34 U1.P97
SDO
  Bottom 0.254: U$2.P$14 34.14,23.98 37.15,26.99 37.15,30.8 35.88,32.07 31.11,32.07 30.16,33.02 30.16,33.66 29.98,33.84 U1.P96
SH
  Bottom 0.254: U$1.P$5 37.75,8.29 34.61,11.43 24.45,11.43 21.59,14.29 19.77,16.11 U1.P16
TCK  (via drill 0.6)
  Top 0.254: v33.02,49.85 32.38,49.85 31.43,48.9 31.43,44.13 v30.8,43.5
  Bottom 0.254: v33.02,49.85 33.02,50.16 33.97,51.12 33.97,52.44 U8.6 33.98,58.75 33.97,58.76 33.97,62.55 31.75,64.77 JTAG.7 | v30.8,43.5 30.64,43.34 U1.P77
TDI
  Bottom 0.254: U8.4 32.69,56.21 32.38,56.52 31.11,57.78 31.11,62.23 29.21,64.14 JTAG.9
TDOE  (via drill 0.6)
  Top 0.254: v32.7,48.26 v32.65,29.88
  Bottom 0.254: U8.17 32.7,46.61 v32.7,48.26 | v32.65,29.88 32.61,29.84 31.43,29.84 29.43,31.84 U1.P100
TMS  (via drill 0.6)
  Top 0.254: v26.99,42.86 28.57,44.45 28.57,52.39 28.57,54.77 29.84,56.04 33.34,56.04 | JTAG.3 37.78,64.77 37.78,57.31 37.78,56.99 36.83,56.04 33.34,56.04 | v32.86,57.47 33.34,56.99 33.34,56.04
  Bottom 0.254: v26.99,42.86 28.95,42.86 U1.P78 | U8.5 33.33,57 v32.86,57.47
VCC5  (via drill 0.6)
  Top 0.61: v53.02,6.03 53.02,1.91
  Top 1.27: v13.65,11.75 21.91,3.49 36.2,3.49 37.15,2.54 37.78,1.91 53.02,1.91 56.83,1.91 v60.01,5.08
  Bottom 0.254: X1.1 56.84,39.38 58.42,40.96 59.05,40.96 59.37,41.27 59.37,41.59 59.37,44.4 C1.1 59.44,44.45 | U$1.P$2 45.65,6.38 U$1.P$1 49.72,6.38 | C17.1 51.97,6.25 | C51.1 13.65,15.72 IC4.1
  Bottom 0.406: 49.72,6.38 49.53,6.38 C17.1
  Bottom 0.61: 51.97,6.25 52.81,6.25 v53.02,6.03
  Bottom 1.27: 60.01,6.99 60.01,14.29 60.01,25.4 C48.1 | 60.01,6.99 v60.01,5.08 60.01,6.99 | C48.1 54.76,25.4 IC6.1 | C48.1 60.01,25.4 60.01,33.97 | C51.1 13.65,13.65 v13.65,11.75
  pour Bottom (isolate 0.406): 64.14,42.55 57.15,42.55 57.15,33.02 64.14,33.02 64.14,42.23
VCC12  (via drill 0.6)
  Bottom 0.254: v15.56,41.27 13.57,41.27 U1.P45 11.64,41.34 C62.1 | v24.13,43.81 24.27,43.81 U1.P69 24.27,46.85 24.13,46.99 23.6,46.99 C64.1 | v27.3,35.56 27.52,35.34 U1.P93 30.68,35.34 C61.1 | v19.05,32.07 18.77,31.79 U1.P18 18.77,28.19 C63.1 | C56.1 12.06,51.27 IC3.3 11.82,49.77 v12.06,47.62
  pour Top (isolate 0.254, rank 2): 14.92,50.8 10.16,50.8 10.16,40.96 14.92,40.96 14.92,31.75 27.62,31.75 27.62,44.13 14.92,44.13
VCC18
  Bottom 0.254: 39.05,41.59 39.05,43.32 IC2.49 39.11,44.87 C10.1 | 39.05,36.03 IC2.37 35.87,36.03 C11.1 | 45.09,41.91 46.61,41.91 IC2.64 | 46.61,36.03 IC2.12 49.47,36.03 C14.1
  pour Bottom (rank 2): 38.42,42.23 38.42,33.34 47.31,33.34 47.31,42.23
VCC25  (via drill 0.6)
  Top 0.254: 34.61,18.73 34.29,18.41 34.29,18.1 | v29.84,46.67 29.84,53.98 31.11,55.24 37.15,55.24 38.42,56.52 38.73,56.83 v38.73,61.28 38.73,65.09 JTAG.1
  Bottom 0.254: 15.88,35.24 15.78,35.34 U1.P33 11.74,35.34 C85.1 | 19.37,43.18 19.37,43.5 18.73,44.13 18.73,45.51 U1.P58 18.77,46.81 C58.1 | 24.12,32.45 24.12,39.84 U1.P84 31.06,39.84 C59.1 | C84.1 12.37,31.84 U1.P26 14.7,31.84 15.24,31.75 15.24,30.17 U1.P25 15.27,29.14 C82.1 13.76,27.62 v12.06,27.62 | C83.1 15.77,28.26 U1.P24 15.77,31.75 15.88,32.07 | C60.1 24.27,29.25 U1.P7 | 34.61,19.03 U$2.P$2 34.64,18.13 C8.1 34.92,16.99 v34.92,16.19 | U8.19 U8.20 | 25.08,42.55 25.08,42.86 26.35,44.13 27.3,44.13 27.62,44.45 28.89,44.45 30.73,46.29 U8.20 | R19.1 R21.1 38.63,61.17 v38.73,61.28 38.73,61.17 R20.2 | U8.20 29.91,46.61 v29.84,46.67 28.57,47.94 C20.1 | C52.1 7.62,15.41 IC4.3 8.48,18.96 v8.57,19.05
  Bottom 0.305: 24.12,32.45 24.27,32.3 U1.P7
  other vias: 20.64,33.97
  pour Bottom (isolate 0.61): 14.92,44.13 27.62,44.13 27.62,31.43 14.92,31.43
  pour Top (isolate 0.406): 22.86,16.03 34.61,16.03 34.61,18.73 25.72,18.73 25.72,23.18 21.27,23.18 21.27,34.61 20,34.61 20,23.18 14.29,23.18 14.29,29.21 6.67,29.21 6.67,12.38 22.86,12.38
VCC33
  Bottom 0.254: C15.1 45.11,30.09 IC2.20 | IC2.31 39.61,30.2 C12.1 41.23,30.12 C19.1 | C13.1 35.64,38.53 IC2.42 | U1.P57 18.27,47.48 18.41,47.62 | U1.P31 11.38,34.34 11.64,34.08 C81.1 | U$2.P$15 34.64,22.2 35.56,22.23 | U1.P19 18.27,28.96 17.53,28.96 17.46,28.89 C78.1 | C73.1 24.77,28.15 U1.P6 | C70.1 24.77,47.41 U1.P70 | C72.1 30.48,34.29 30.16,34.61 29.93,34.84 U1.P94 | IC2.50 39.61,44.06 40.01,44.45 40.54,44.45 C2.1 42.01,44.45 42.55,44.45 42.61,44.38 IC2.56 | C76.1 30.58,41.59 30.16,40.64 30.18,40.34 U1.P83 | R4.2 R3.2 R5.2 50.06,52.49 49.53,53.02 47.7,53.02 | U8.18 32.03,45.13 C22.1
  pour Bottom (isolate 0.305, rank 6): 12,71.75 12,54.93 2.54,50.48 2.54,2.54 61.21,2.54 61.21,71.75

### Text on the board
bPlace: v2.0 | ICG | SH